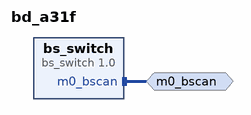
[diagram p0: block diagram of the top level]
# Vivado block design bd_a31f, xc7k325tffg676-1, Vivado 2022.1
create_bd_design bd_a31f

create_bd_intf_port -mode Master -vlnv xilinx.com:interface:bscan_rtl:1.0 m0_bscan

create_bd_cell -type ip -vlnv xilinx.com:ip:bs_switch:1.0 bs_switch
set_property -dict [list \
  CONFIG.C_NUM_BS_MASTER 1 \
  CONFIG.C_ONLY_PRIMITIVE false \
  CONFIG.C_USER_SCAN_CHAIN 1 \
  CONFIG.C_USE_EXT_BSCAN false \
] [get_bd_cells bs_switch]

# ---- connections ----

connect_bd_intf_net [get_bd_intf_ports m0_bscan] [get_bd_intf_pins bs_switch/m0_bscan]

validate_bd_design
save_bd_design
